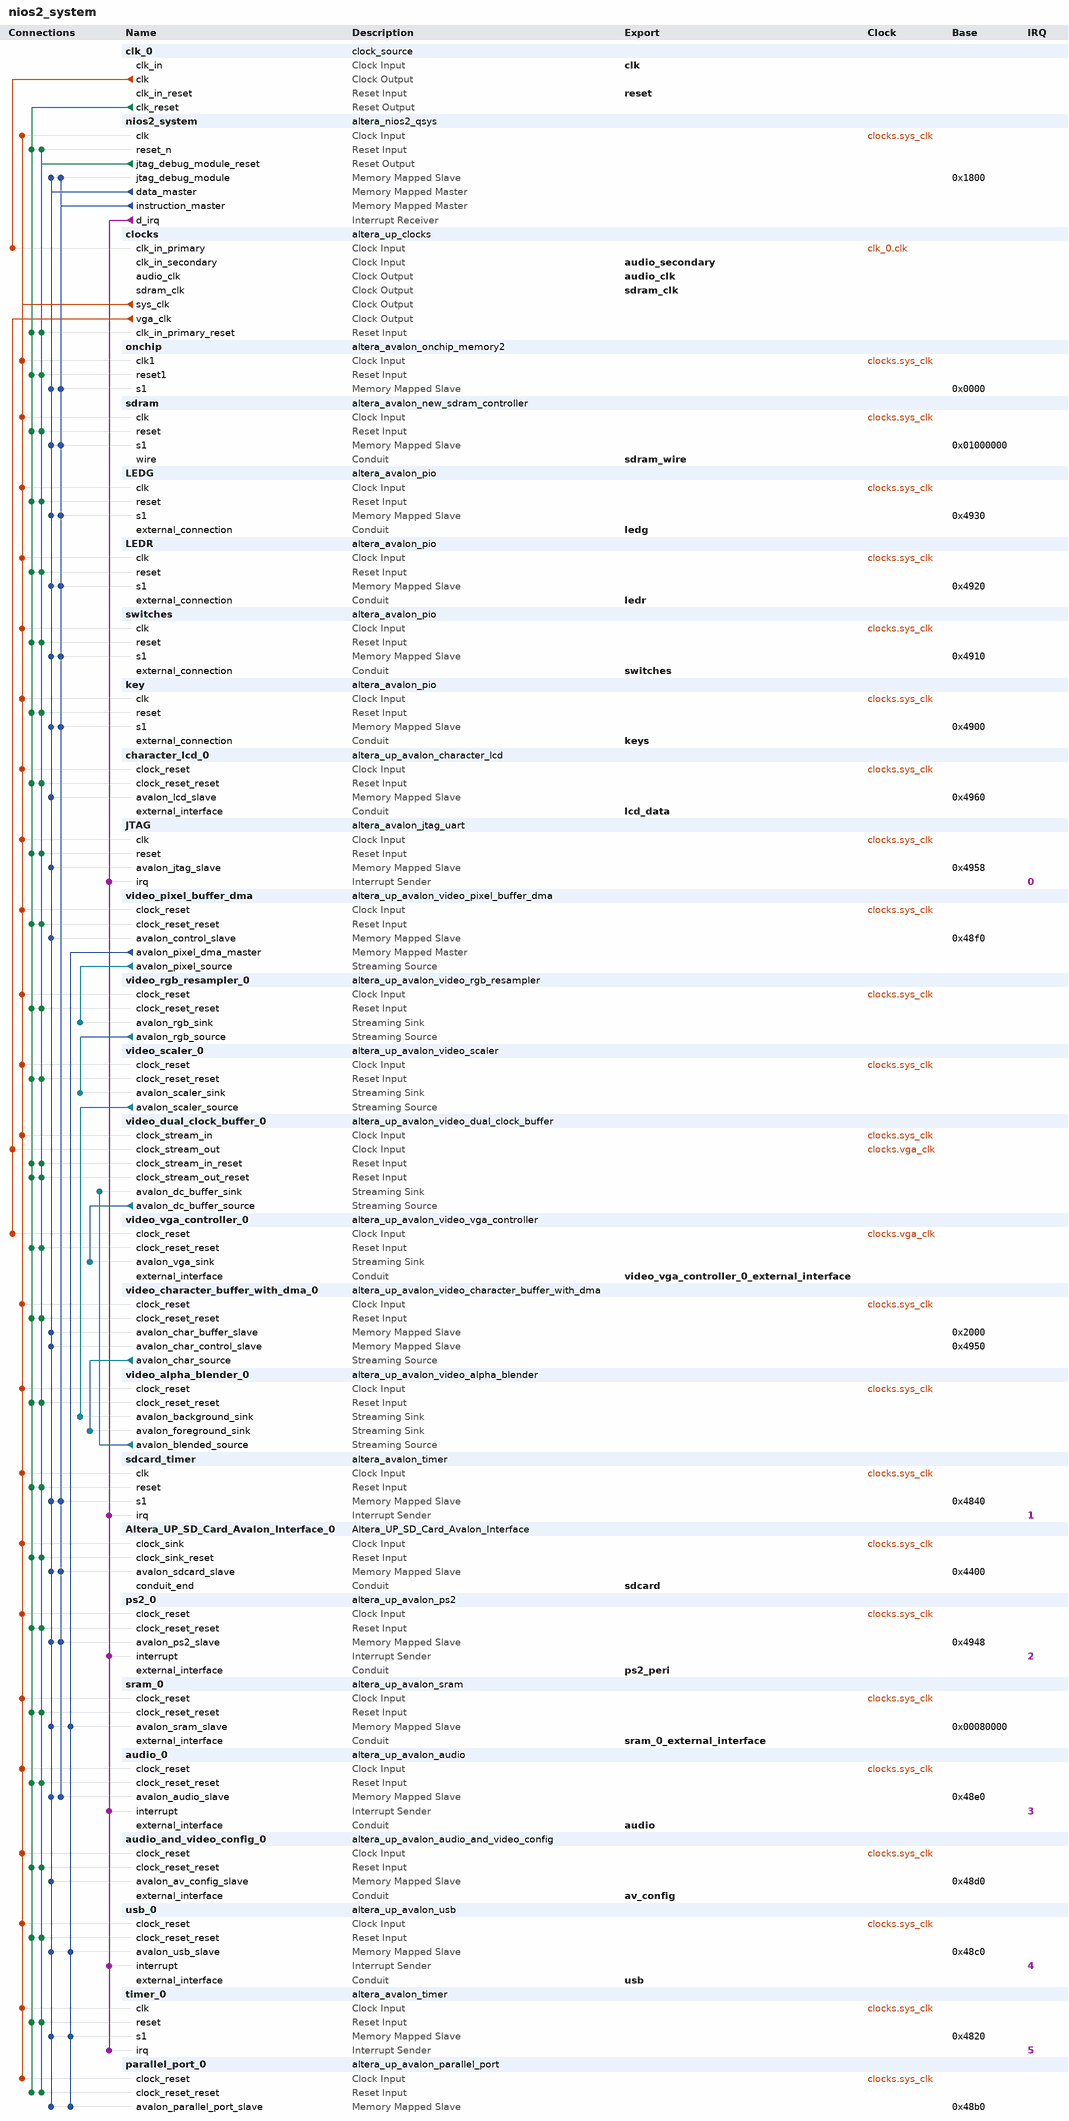
[diagram p0: system contents]
# Platform Designer (Qsys) system nios2_system, Cyclone II EP2C35F672C6
# Parameters at their usual value, and those the tool derives, are not listed.
package require -exact qsys 13.0
create_system nios2_system
set_project_property DEVICE_FAMILY {Cyclone II}
set_project_property DEVICE EP2C35F672C6

add_instance clk_0 clock_source 13.0
set_instance_parameter_value clk_0 clockFrequency 50000000

add_instance nios2_system altera_nios2_qsys 13.0
set_instance_parameter_value nios2_system resetSlave sdram.s1
set_instance_parameter_value nios2_system mmu_TLBMissExcSlave None
set_instance_parameter_value nios2_system exceptionSlave sdram.s1
set_instance_parameter_value nios2_system breakSlave nios2_system.jtag_debug_module
set_instance_parameter_value nios2_system impl Fast
set_instance_parameter_value nios2_system icache_size 4096

add_instance clocks altera_up_clocks 13.0
set_instance_parameter_value clocks board DE2
set_instance_parameter_value clocks vga_clk true
set_instance_parameter_value clocks audio_clk true
set_instance_parameter_value clocks audio_clk_freq 12.288

add_instance onchip altera_avalon_onchip_memory2 13.0.1.99.2
set_instance_parameter_value onchip dataWidth 32
set_instance_parameter_value onchip dualPort false
set_instance_parameter_value onchip initMemContent true
set_instance_parameter_value onchip initializationFileName onchip_mem.hex
set_instance_parameter_value onchip memorySize 4096

add_instance sdram altera_avalon_new_sdram_controller 13.0.1.99.2
set_instance_parameter_value sdram TAC 5.5
set_instance_parameter_value sdram TRCD 20.0
set_instance_parameter_value sdram TRP 20.0
set_instance_parameter_value sdram casLatency 3
set_instance_parameter_value sdram columnWidth 8
set_instance_parameter_value sdram dataWidth 16
set_instance_parameter_value sdram generateSimulationModel false
set_instance_parameter_value sdram model single_Micron_MT48LC4M32B2_7_chip
set_instance_parameter_value sdram numberOfBanks 4
set_instance_parameter_value sdram numberOfChipSelects 1
set_instance_parameter_value sdram powerUpDelay 100.0
set_instance_parameter_value sdram refreshPeriod 15.625
set_instance_parameter_value sdram rowWidth 12

add_instance LEDG altera_avalon_pio 13.0.1.99.2
set_instance_parameter_value LEDG direction Output
set_instance_parameter_value LEDG width 8

add_instance LEDR altera_avalon_pio 13.0.1.99.2
set_instance_parameter_value LEDR direction Output
set_instance_parameter_value LEDR width 18

add_instance switches altera_avalon_pio 13.0.1.99.2
set_instance_parameter_value switches direction Input
set_instance_parameter_value switches width 18

add_instance key altera_avalon_pio 13.0.1.99.2
set_instance_parameter_value key direction Input
set_instance_parameter_value key width 4

add_instance character_lcd_0 altera_up_avalon_character_lcd 13.0
set_instance_parameter_value character_lcd_0 cursor Normal

add_instance JTAG altera_avalon_jtag_uart 13.0.1.99.2
set_instance_parameter_value JTAG simInteractiveOptions NO_INTERACTIVE_WINDOWS

add_instance video_pixel_buffer_dma altera_up_avalon_video_pixel_buffer_dma 13.0
set_instance_parameter_value video_pixel_buffer_dma addr_mode X-Y
set_instance_parameter_value video_pixel_buffer_dma start_address 0
set_instance_parameter_value video_pixel_buffer_dma back_start_address 0
set_instance_parameter_value video_pixel_buffer_dma image_width 320
set_instance_parameter_value video_pixel_buffer_dma image_height 240
set_instance_parameter_value video_pixel_buffer_dma color_space {16-bit RGB}

add_instance video_rgb_resampler_0 altera_up_avalon_video_rgb_resampler 13.0
set_instance_parameter_value video_rgb_resampler_0 input_type {16-bit RGB}
set_instance_parameter_value video_rgb_resampler_0 output_type {30-bit RGB}
set_instance_parameter_value video_rgb_resampler_0 alpha 1023

add_instance video_scaler_0 altera_up_avalon_video_scaler 13.0
set_instance_parameter_value video_scaler_0 width_scaling 2
set_instance_parameter_value video_scaler_0 height_scaling 2
set_instance_parameter_value video_scaler_0 width_in 320
set_instance_parameter_value video_scaler_0 color_bits 10
set_instance_parameter_value video_scaler_0 color_planes 3

add_instance video_dual_clock_buffer_0 altera_up_avalon_video_dual_clock_buffer 13.0
set_instance_parameter_value video_dual_clock_buffer_0 color_bits 10

add_instance video_vga_controller_0 altera_up_avalon_video_vga_controller 13.0
set_instance_parameter_value video_vga_controller_0 board DE2

add_instance video_character_buffer_with_dma_0 altera_up_avalon_video_character_buffer_with_dma 13.0
set_instance_parameter_value video_character_buffer_with_dma_0 enable_transparency true

add_instance video_alpha_blender_0 altera_up_avalon_video_alpha_blender 13.0

add_instance sdcard_timer altera_avalon_timer 13.0.1.99.2
set_instance_parameter_value sdcard_timer period 1
set_instance_parameter_value sdcard_timer periodUnits MSEC

add_instance Altera_UP_SD_Card_Avalon_Interface_0 Altera_UP_SD_Card_Avalon_Interface 13.0

add_instance ps2_0 altera_up_avalon_ps2 13.0

add_instance sram_0 altera_up_avalon_sram 13.0
set_instance_parameter_value sram_0 board DE2
set_instance_parameter_value sram_0 pixel_buffer true

add_instance audio_0 altera_up_avalon_audio 13.0
set_instance_parameter_value audio_0 avalon_bus_type {Memory Mapped}
set_instance_parameter_value audio_0 audio_in true
set_instance_parameter_value audio_0 dw 16

add_instance audio_and_video_config_0 altera_up_avalon_audio_and_video_config 13.0
set_instance_parameter_value audio_and_video_config_0 board DE2
set_instance_parameter_value audio_and_video_config_0 audio_in {Microphone to ADC}
set_instance_parameter_value audio_and_video_config_0 line_in_bypass false
set_instance_parameter_value audio_and_video_config_0 bit_length 16
set_instance_parameter_value audio_and_video_config_0 sampling_rate {32 kHz}

add_instance usb_0 altera_up_avalon_usb 13.0

add_instance timer_0 altera_avalon_timer 13.0.1.99.2
set_instance_parameter_value timer_0 period 25
set_instance_parameter_value timer_0 periodUnits MSEC

add_instance parallel_port_0 altera_up_avalon_parallel_port 13.0
set_instance_parameter_value parallel_port_0 board DE2
set_instance_parameter_value parallel_port_0 custom_port true
set_instance_parameter_value parallel_port_0 preset Pushbuttons
set_instance_parameter_value parallel_port_0 capture false
set_instance_parameter_value parallel_port_0 edge Rising
set_instance_parameter_value parallel_port_0 irq false

# connections
add_connection clk_0.clk clocks.clk_in_primary clock
add_connection clocks.sys_clk Altera_UP_SD_Card_Avalon_Interface_0.clock_sink clock
add_connection clocks.sys_clk audio_0.clock_reset clock
add_connection clocks.sys_clk audio_and_video_config_0.clock_reset clock
add_connection clocks.sys_clk character_lcd_0.clock_reset clock
add_connection clocks.sys_clk JTAG.clk clock
add_connection clocks.sys_clk key.clk clock
add_connection clocks.sys_clk LEDG.clk clock
add_connection clocks.sys_clk LEDR.clk clock
add_connection clocks.sys_clk nios2_system.clk clock
add_connection clocks.sys_clk onchip.clk1 clock
add_connection clocks.sys_clk parallel_port_0.clock_reset clock
add_connection clocks.sys_clk ps2_0.clock_reset clock
add_connection clocks.sys_clk sdcard_timer.clk clock
add_connection clocks.sys_clk sdram.clk clock
add_connection clocks.sys_clk sram_0.clock_reset clock
add_connection clocks.sys_clk switches.clk clock
add_connection clocks.sys_clk timer_0.clk clock
add_connection clocks.sys_clk usb_0.clock_reset clock
add_connection clocks.sys_clk video_alpha_blender_0.clock_reset clock
add_connection clocks.sys_clk video_character_buffer_with_dma_0.clock_reset clock
add_connection clocks.sys_clk video_dual_clock_buffer_0.clock_stream_in clock
add_connection clocks.sys_clk video_pixel_buffer_dma.clock_reset clock
add_connection clocks.sys_clk video_rgb_resampler_0.clock_reset clock
add_connection clocks.sys_clk video_scaler_0.clock_reset clock
add_connection clocks.vga_clk video_dual_clock_buffer_0.clock_stream_out clock
add_connection clocks.vga_clk video_vga_controller_0.clock_reset clock
add_connection clk_0.clk_reset Altera_UP_SD_Card_Avalon_Interface_0.clock_sink_reset reset
add_connection clk_0.clk_reset audio_0.clock_reset_reset reset
add_connection clk_0.clk_reset audio_and_video_config_0.clock_reset_reset reset
add_connection clk_0.clk_reset character_lcd_0.clock_reset_reset reset
add_connection clk_0.clk_reset clocks.clk_in_primary_reset reset
add_connection clk_0.clk_reset JTAG.reset reset
add_connection clk_0.clk_reset key.reset reset
add_connection clk_0.clk_reset LEDG.reset reset
add_connection clk_0.clk_reset LEDR.reset reset
add_connection clk_0.clk_reset nios2_system.reset_n reset
add_connection clk_0.clk_reset onchip.reset1 reset
add_connection clk_0.clk_reset parallel_port_0.clock_reset_reset reset
add_connection clk_0.clk_reset ps2_0.clock_reset_reset reset
add_connection clk_0.clk_reset sdcard_timer.reset reset
add_connection clk_0.clk_reset sdram.reset reset
add_connection clk_0.clk_reset sram_0.clock_reset_reset reset
add_connection clk_0.clk_reset switches.reset reset
add_connection clk_0.clk_reset timer_0.reset reset
add_connection clk_0.clk_reset usb_0.clock_reset_reset reset
add_connection clk_0.clk_reset video_alpha_blender_0.clock_reset_reset reset
add_connection clk_0.clk_reset video_character_buffer_with_dma_0.clock_reset_reset reset
add_connection clk_0.clk_reset video_dual_clock_buffer_0.clock_stream_in_reset reset
add_connection clk_0.clk_reset video_dual_clock_buffer_0.clock_stream_out_reset reset
add_connection clk_0.clk_reset video_pixel_buffer_dma.clock_reset_reset reset
add_connection clk_0.clk_reset video_rgb_resampler_0.clock_reset_reset reset
add_connection clk_0.clk_reset video_scaler_0.clock_reset_reset reset
add_connection clk_0.clk_reset video_vga_controller_0.clock_reset_reset reset
add_connection nios2_system.jtag_debug_module_reset Altera_UP_SD_Card_Avalon_Interface_0.clock_sink_reset reset
add_connection nios2_system.jtag_debug_module_reset audio_0.clock_reset_reset reset
add_connection nios2_system.jtag_debug_module_reset audio_and_video_config_0.clock_reset_reset reset
add_connection nios2_system.jtag_debug_module_reset character_lcd_0.clock_reset_reset reset
add_connection nios2_system.jtag_debug_module_reset clocks.clk_in_primary_reset reset
add_connection nios2_system.jtag_debug_module_reset JTAG.reset reset
add_connection nios2_system.jtag_debug_module_reset key.reset reset
add_connection nios2_system.jtag_debug_module_reset LEDG.reset reset
add_connection nios2_system.jtag_debug_module_reset LEDR.reset reset
add_connection nios2_system.jtag_debug_module_reset nios2_system.reset_n reset
add_connection nios2_system.jtag_debug_module_reset onchip.reset1 reset
add_connection nios2_system.jtag_debug_module_reset parallel_port_0.clock_reset_reset reset
add_connection nios2_system.jtag_debug_module_reset ps2_0.clock_reset_reset reset
add_connection nios2_system.jtag_debug_module_reset sdcard_timer.reset reset
add_connection nios2_system.jtag_debug_module_reset sdram.reset reset
add_connection nios2_system.jtag_debug_module_reset sram_0.clock_reset_reset reset
add_connection nios2_system.jtag_debug_module_reset switches.reset reset
add_connection nios2_system.jtag_debug_module_reset timer_0.reset reset
add_connection nios2_system.jtag_debug_module_reset usb_0.clock_reset_reset reset
add_connection nios2_system.jtag_debug_module_reset video_alpha_blender_0.clock_reset_reset reset
add_connection nios2_system.jtag_debug_module_reset video_character_buffer_with_dma_0.clock_reset_reset reset
add_connection nios2_system.jtag_debug_module_reset video_dual_clock_buffer_0.clock_stream_in_reset reset
add_connection nios2_system.jtag_debug_module_reset video_dual_clock_buffer_0.clock_stream_out_reset reset
add_connection nios2_system.jtag_debug_module_reset video_pixel_buffer_dma.clock_reset_reset reset
add_connection nios2_system.jtag_debug_module_reset video_rgb_resampler_0.clock_reset_reset reset
add_connection nios2_system.jtag_debug_module_reset video_scaler_0.clock_reset_reset reset
add_connection nios2_system.jtag_debug_module_reset video_vga_controller_0.clock_reset_reset reset
add_connection nios2_system.data_master Altera_UP_SD_Card_Avalon_Interface_0.avalon_sdcard_slave avalon
set_connection_parameter_value nios2_system.data_master/Altera_UP_SD_Card_Avalon_Interface_0.avalon_sdcard_slave baseAddress 0x4400
add_connection nios2_system.data_master audio_0.avalon_audio_slave avalon
set_connection_parameter_value nios2_system.data_master/audio_0.avalon_audio_slave baseAddress 0x48e0
add_connection nios2_system.data_master audio_and_video_config_0.avalon_av_config_slave avalon
set_connection_parameter_value nios2_system.data_master/audio_and_video_config_0.avalon_av_config_slave baseAddress 0x48d0
add_connection nios2_system.data_master character_lcd_0.avalon_lcd_slave avalon
set_connection_parameter_value nios2_system.data_master/character_lcd_0.avalon_lcd_slave baseAddress 0x4960
add_connection nios2_system.data_master JTAG.avalon_jtag_slave avalon
set_connection_parameter_value nios2_system.data_master/JTAG.avalon_jtag_slave baseAddress 0x4958
add_connection nios2_system.data_master key.s1 avalon
set_connection_parameter_value nios2_system.data_master/key.s1 baseAddress 0x4900
add_connection nios2_system.data_master LEDG.s1 avalon
set_connection_parameter_value nios2_system.data_master/LEDG.s1 baseAddress 0x4930
add_connection nios2_system.data_master LEDR.s1 avalon
set_connection_parameter_value nios2_system.data_master/LEDR.s1 baseAddress 0x4920
add_connection nios2_system.data_master nios2_system.jtag_debug_module avalon
set_connection_parameter_value nios2_system.data_master/nios2_system.jtag_debug_module baseAddress 0x1800
add_connection nios2_system.data_master onchip.s1 avalon
set_connection_parameter_value nios2_system.data_master/onchip.s1 baseAddress 0x0000
add_connection nios2_system.data_master parallel_port_0.avalon_parallel_port_slave avalon
set_connection_parameter_value nios2_system.data_master/parallel_port_0.avalon_parallel_port_slave baseAddress 0x48b0
add_connection nios2_system.data_master ps2_0.avalon_ps2_slave avalon
set_connection_parameter_value nios2_system.data_master/ps2_0.avalon_ps2_slave baseAddress 0x4948
add_connection nios2_system.data_master sdcard_timer.s1 avalon
set_connection_parameter_value nios2_system.data_master/sdcard_timer.s1 baseAddress 0x4840
add_connection nios2_system.data_master sdram.s1 avalon
set_connection_parameter_value nios2_system.data_master/sdram.s1 baseAddress 0x01000000
add_connection nios2_system.data_master sram_0.avalon_sram_slave avalon
set_connection_parameter_value nios2_system.data_master/sram_0.avalon_sram_slave baseAddress 0x00080000
add_connection nios2_system.data_master switches.s1 avalon
set_connection_parameter_value nios2_system.data_master/switches.s1 baseAddress 0x4910
add_connection nios2_system.data_master timer_0.s1 avalon
set_connection_parameter_value nios2_system.data_master/timer_0.s1 baseAddress 0x4820
add_connection nios2_system.data_master usb_0.avalon_usb_slave avalon
set_connection_parameter_value nios2_system.data_master/usb_0.avalon_usb_slave baseAddress 0x48c0
add_connection nios2_system.data_master video_character_buffer_with_dma_0.avalon_char_buffer_slave avalon
set_connection_parameter_value nios2_system.data_master/video_character_buffer_with_dma_0.avalon_char_buffer_slave baseAddress 0x2000
add_connection nios2_system.data_master video_character_buffer_with_dma_0.avalon_char_control_slave avalon
set_connection_parameter_value nios2_system.data_master/video_character_buffer_with_dma_0.avalon_char_control_slave baseAddress 0x4950
add_connection nios2_system.data_master video_pixel_buffer_dma.avalon_control_slave avalon
set_connection_parameter_value nios2_system.data_master/video_pixel_buffer_dma.avalon_control_slave baseAddress 0x48f0
add_connection nios2_system.instruction_master Altera_UP_SD_Card_Avalon_Interface_0.avalon_sdcard_slave avalon
set_connection_parameter_value nios2_system.instruction_master/Altera_UP_SD_Card_Avalon_Interface_0.avalon_sdcard_slave baseAddress 0x4400
add_connection nios2_system.instruction_master audio_0.avalon_audio_slave avalon
set_connection_parameter_value nios2_system.instruction_master/audio_0.avalon_audio_slave baseAddress 0x48e0
add_connection nios2_system.instruction_master key.s1 avalon
set_connection_parameter_value nios2_system.instruction_master/key.s1 baseAddress 0x4900
add_connection nios2_system.instruction_master LEDG.s1 avalon
set_connection_parameter_value nios2_system.instruction_master/LEDG.s1 baseAddress 0x4930
add_connection nios2_system.instruction_master LEDR.s1 avalon
set_connection_parameter_value nios2_system.instruction_master/LEDR.s1 baseAddress 0x4920
add_connection nios2_system.instruction_master nios2_system.jtag_debug_module avalon
set_connection_parameter_value nios2_system.instruction_master/nios2_system.jtag_debug_module baseAddress 0x1800
add_connection nios2_system.instruction_master onchip.s1 avalon
set_connection_parameter_value nios2_system.instruction_master/onchip.s1 baseAddress 0x0000
add_connection nios2_system.instruction_master ps2_0.avalon_ps2_slave avalon
set_connection_parameter_value nios2_system.instruction_master/ps2_0.avalon_ps2_slave baseAddress 0x4948
add_connection nios2_system.instruction_master sdcard_timer.s1 avalon
set_connection_parameter_value nios2_system.instruction_master/sdcard_timer.s1 baseAddress 0x4840
add_connection nios2_system.instruction_master sdram.s1 avalon
set_connection_parameter_value nios2_system.instruction_master/sdram.s1 baseAddress 0x01000000
add_connection nios2_system.instruction_master switches.s1 avalon
set_connection_parameter_value nios2_system.instruction_master/switches.s1 baseAddress 0x4910
add_connection video_pixel_buffer_dma.avalon_pixel_dma_master parallel_port_0.avalon_parallel_port_slave avalon
set_connection_parameter_value video_pixel_buffer_dma.avalon_pixel_dma_master/parallel_port_0.avalon_parallel_port_slave baseAddress 0x48b0
add_connection video_pixel_buffer_dma.avalon_pixel_dma_master sram_0.avalon_sram_slave avalon
set_connection_parameter_value video_pixel_buffer_dma.avalon_pixel_dma_master/sram_0.avalon_sram_slave baseAddress 0x00080000
add_connection video_pixel_buffer_dma.avalon_pixel_dma_master timer_0.s1 avalon
set_connection_parameter_value video_pixel_buffer_dma.avalon_pixel_dma_master/timer_0.s1 baseAddress 0x4820
add_connection video_pixel_buffer_dma.avalon_pixel_dma_master usb_0.avalon_usb_slave avalon
set_connection_parameter_value video_pixel_buffer_dma.avalon_pixel_dma_master/usb_0.avalon_usb_slave baseAddress 0x48c0
add_connection video_alpha_blender_0.avalon_blended_source video_dual_clock_buffer_0.avalon_dc_buffer_sink avalon_streaming
add_connection video_character_buffer_with_dma_0.avalon_char_source video_alpha_blender_0.avalon_foreground_sink avalon_streaming
add_connection video_dual_clock_buffer_0.avalon_dc_buffer_source video_vga_controller_0.avalon_vga_sink avalon_streaming
add_connection video_pixel_buffer_dma.avalon_pixel_source video_rgb_resampler_0.avalon_rgb_sink avalon_streaming
add_connection video_rgb_resampler_0.avalon_rgb_source video_scaler_0.avalon_scaler_sink avalon_streaming
add_connection video_scaler_0.avalon_scaler_source video_alpha_blender_0.avalon_background_sink avalon_streaming
add_connection nios2_system.d_irq audio_0.interrupt interrupt
set_connection_parameter_value nios2_system.d_irq/audio_0.interrupt irqNumber 3
add_connection nios2_system.d_irq JTAG.irq interrupt
set_connection_parameter_value nios2_system.d_irq/JTAG.irq irqNumber 0
add_connection nios2_system.d_irq ps2_0.interrupt interrupt
set_connection_parameter_value nios2_system.d_irq/ps2_0.interrupt irqNumber 2
add_connection nios2_system.d_irq sdcard_timer.irq interrupt
set_connection_parameter_value nios2_system.d_irq/sdcard_timer.irq irqNumber 1
add_connection nios2_system.d_irq timer_0.irq interrupt
set_connection_parameter_value nios2_system.d_irq/timer_0.irq irqNumber 5
add_connection nios2_system.d_irq usb_0.interrupt interrupt
set_connection_parameter_value nios2_system.d_irq/usb_0.interrupt irqNumber 4

# exported interfaces
add_interface clk clock sink
set_interface_property clk EXPORT_OF clk_0.clk_in
add_interface reset reset sink
set_interface_property reset EXPORT_OF clk_0.clk_in_reset
add_interface sdram_wire conduit end
set_interface_property sdram_wire EXPORT_OF sdram.wire
add_interface ledg conduit end
set_interface_property ledg EXPORT_OF LEDG.external_connection
add_interface ledr conduit end
set_interface_property ledr EXPORT_OF LEDR.external_connection
add_interface switches conduit end
set_interface_property switches EXPORT_OF switches.external_connection
add_interface keys conduit end
set_interface_property keys EXPORT_OF key.external_connection
add_interface lcd_data conduit end
set_interface_property lcd_data EXPORT_OF character_lcd_0.external_interface
add_interface video_vga_controller_0_external_interface conduit end
set_interface_property video_vga_controller_0_external_interface EXPORT_OF video_vga_controller_0.external_interface
add_interface sdcard conduit end
set_interface_property sdcard EXPORT_OF Altera_UP_SD_Card_Avalon_Interface_0.conduit_end
add_interface ps2_peri conduit end
set_interface_property ps2_peri EXPORT_OF ps2_0.external_interface
add_interface sram_0_external_interface conduit end
set_interface_property sram_0_external_interface EXPORT_OF sram_0.external_interface
add_interface audio conduit end
set_interface_property audio EXPORT_OF audio_0.external_interface
add_interface sdram_clk clock source
set_interface_property sdram_clk EXPORT_OF clocks.sdram_clk
add_interface audio_secondary clock sink
set_interface_property audio_secondary EXPORT_OF clocks.clk_in_secondary
add_interface audio_clk clock source
set_interface_property audio_clk EXPORT_OF clocks.audio_clk
add_interface av_config conduit end
set_interface_property av_config EXPORT_OF audio_and_video_config_0.external_interface
add_interface usb conduit end
set_interface_property usb EXPORT_OF usb_0.external_interface

set_interconnect_requirement {$system} qsys_mm.clockCrossingAdapter HANDSHAKE
set_interconnect_requirement {$system} qsys_mm.maxAdditionalLatency 1

save_system nios2_system.qsys
